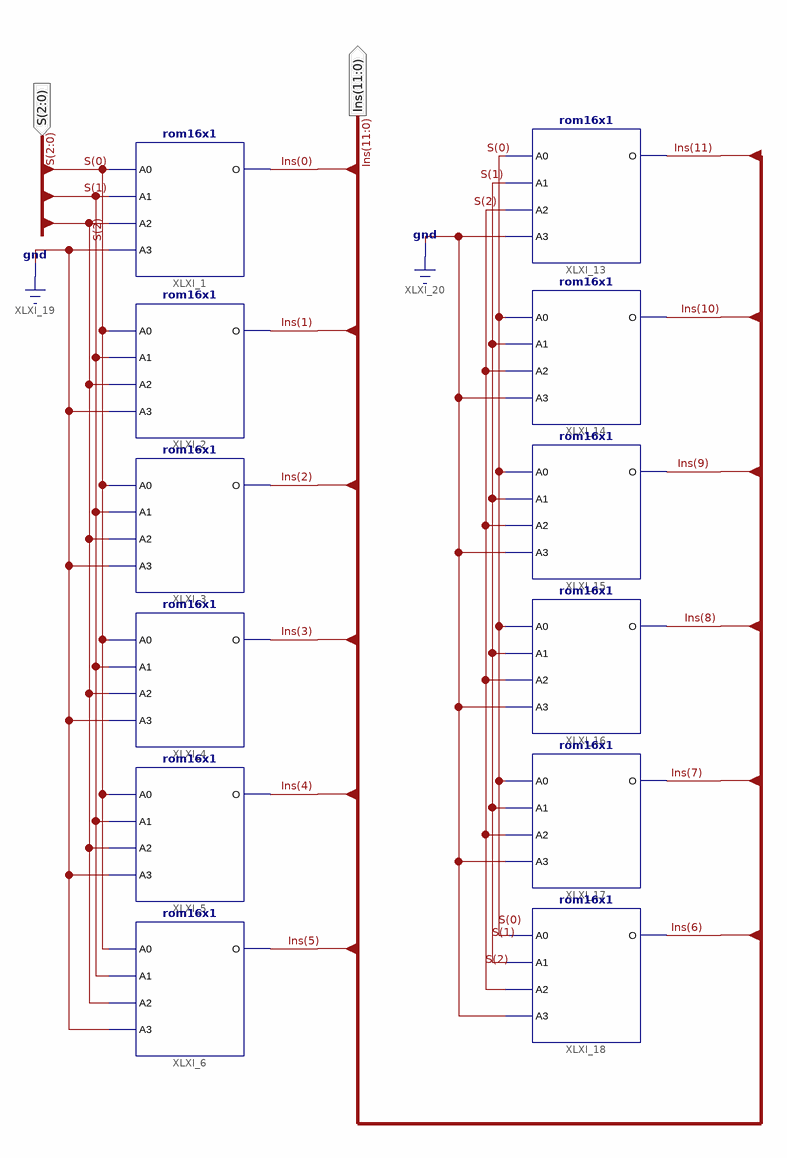
[diagram p0: schematic sheet 1]
// Xilinx ISE schematic ROM.sch (spartan3e) as structural Verilog: 12 symbols, 2 ports
module ROM (
  input  [2:0] S,
  output [11:0] Ins
);

  rom16x1 #(.INIT("0063")) XLXI_1 (.A0(S[0]), .A1(S[1]), .A2(S[2]), .A3(1'b0), .O(Ins[0]));
  rom16x1 #(.INIT("0061")) XLXI_2 (.A0(S[0]), .A1(S[1]), .A2(S[2]), .A3(1'b0), .O(Ins[1]));
  rom16x1 #(.INIT("0020")) XLXI_3 (.A0(S[0]), .A1(S[1]), .A2(S[2]), .A3(1'b0), .O(Ins[2]));
  rom16x1 #(.INIT("0000")) XLXI_4 (.A0(S[0]), .A1(S[1]), .A2(S[2]), .A3(1'b0), .O(Ins[3]));
  rom16x1 #(.INIT("0008")) XLXI_5 (.A0(S[0]), .A1(S[1]), .A2(S[2]), .A3(1'b0), .O(Ins[4]));
  rom16x1 #(.INIT("0010")) XLXI_6 (.A0(S[0]), .A1(S[1]), .A2(S[2]), .A3(1'b0), .O(Ins[5]));
  rom16x1 #(.INIT("0063")) XLXI_13 (.A0(S[0]), .A1(S[1]), .A2(S[2]), .A3(1'b0), .O(Ins[11]));
  rom16x1 #(.INIT("0064")) XLXI_14 (.A0(S[0]), .A1(S[1]), .A2(S[2]), .A3(1'b0), .O(Ins[10]));
  rom16x1 #(.INIT("0008")) XLXI_15 (.A0(S[0]), .A1(S[1]), .A2(S[2]), .A3(1'b0), .O(Ins[9]));
  rom16x1 #(.INIT("000E")) XLXI_16 (.A0(S[0]), .A1(S[1]), .A2(S[2]), .A3(1'b0), .O(Ins[8]));
  rom16x1 #(.INIT("0039")) XLXI_17 (.A0(S[0]), .A1(S[1]), .A2(S[2]), .A3(1'b0), .O(Ins[7]));
  rom16x1 #(.INIT("0000")) XLXI_18 (.A0(S[0]), .A1(S[1]), .A2(S[2]), .A3(1'b0), .O(Ins[6]));
endmodule
